# Altium schematic sheet 51-039原理图（源文件格式）.SCHDOC
size A4
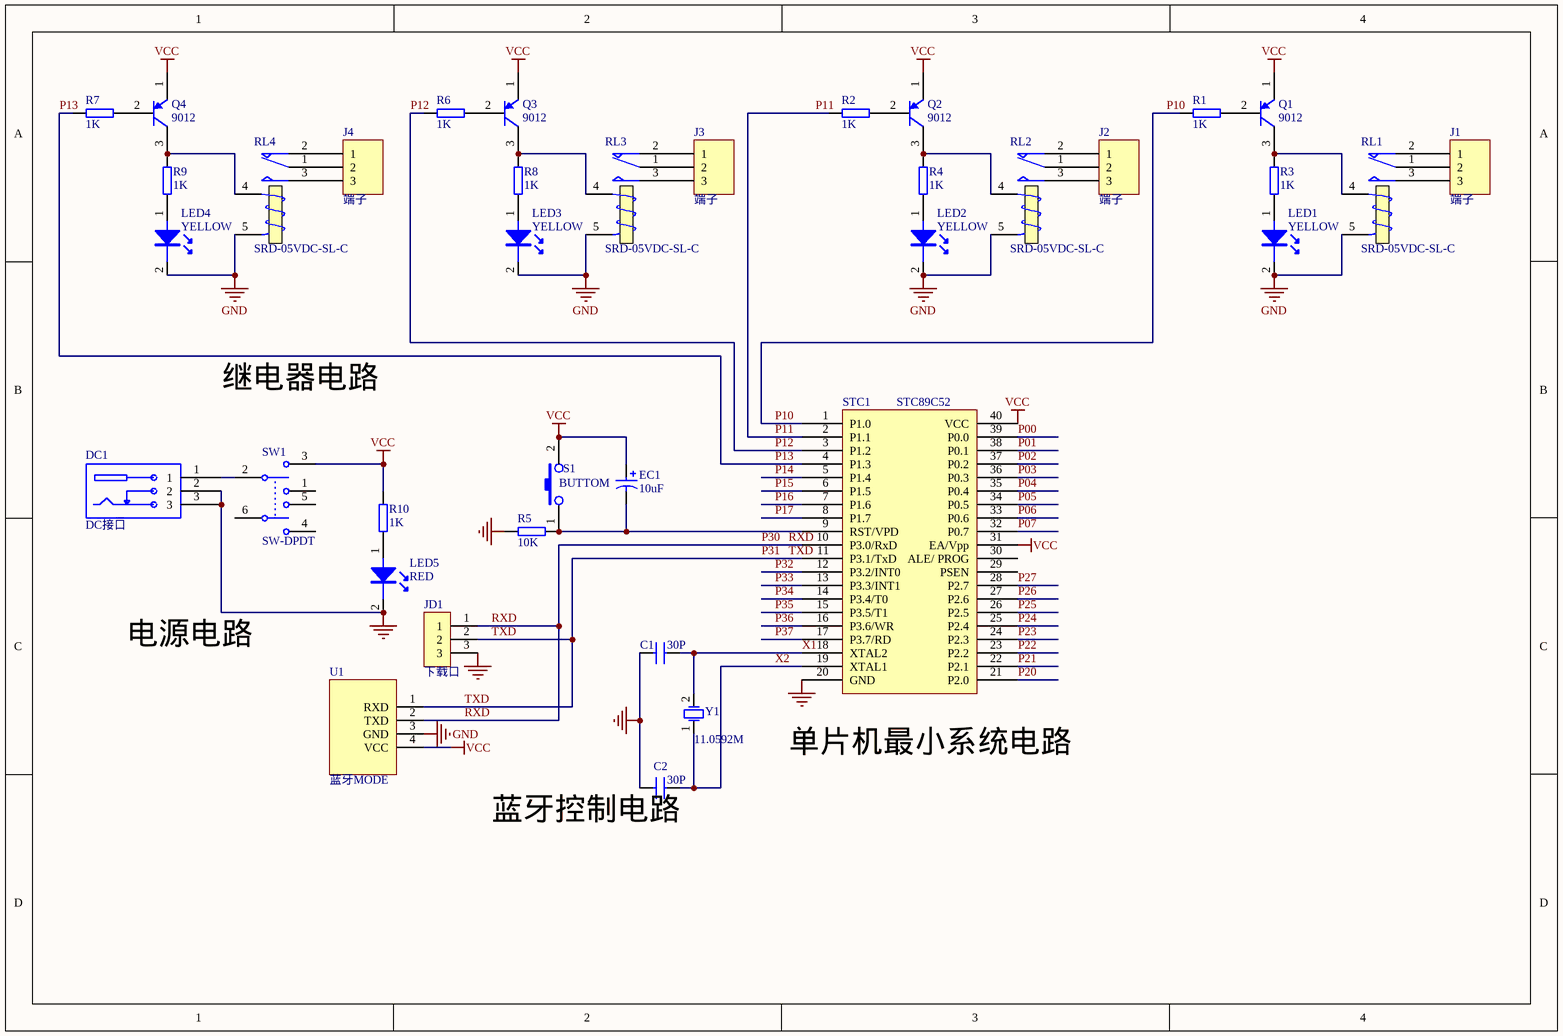
[diagram p0: 51-039原理图（源文件格式）.SCHDOC]

## Parts
C1  30P  [RAD-0.1]
C2  30P  [RAD-0.1]
DC1  DC接口  [DC-JACK-002]
EC1  10uF  [RB.1/.2]
J1  端子  [5.08三芯接线端子]
J2  端子  [5.08三芯接线端子]
J3  端子  [5.08三芯接线端子]
J4  端子  [5.08三芯接线端子]
JD1  下载口  [下载串口]
LED1  YELLOW  [LED_D3MM12]
LED2  YELLOW  [LED_D3MM12]
LED3  YELLOW  [LED_D3MM12]
LED4  YELLOW  [LED_D3MM12]
LED5  RED  [LED_D3MM12]
Q1  9012  [TO-92]
Q2  9012  [TO-92]
Q3  9012  [TO-92]
Q4  9012  [TO-92]
R1  1K  [AXIAL0.3]
R2  1K  [AXIAL0.3]
R3  1K  [AXIAL0.3]
R4  1K  [AXIAL0.3]
R5  10K  [AXIAL0.3]
R6  1K  [AXIAL0.3]
R7  1K  [AXIAL0.3]
R8  1K  [AXIAL0.3]
R9  1K  [AXIAL0.3]
R10  1K  [AXIAL0.3]
RL1  SRD-05VDC-SL-C  [RELAY_5V51BOARD]
RL2  SRD-05VDC-SL-C  [RELAY_5V51BOARD]
RL3  SRD-05VDC-SL-C  [RELAY_5V51BOARD]
RL4  SRD-05VDC-SL-C  [RELAY_5V51BOARD]
S1  BUTTOM  [BUTTOM_6x6DIP]
STC1  STC89C52  [STC89]
SW1  SW-DPDT  [SW]
U1  蓝牙MODE  [蓝牙MODE竖放]
Y1  11.0592M  [X_HC-49]

## Nets
GND: C1.1 C2.1 DC1.2 DC1.3 JD1.3 LED1.2 LED2.2 LED3.2 LED4.2 LED5.2 R5.1 RL1.5(T2) RL2.5(T2) RL3.5(T2) RL4.5(T2) STC1.20(GND) U1.3(GND)
VCC: EC1.1 Q1.1(e) Q2.1(e) Q3.1(e) Q4.1(e) R10.2 S1.2 STC1.31(EA/Vpp) STC1.40(VCC) SW1.3 U1.4(VCC)
P00: STC1.39(P0.0)
P01: STC1.38(P0.1)
P02: STC1.37(P0.2)
P03: STC1.36(P0.3)
P04: STC1.35(P0.4)
P05: STC1.34(P0.5)
P06: STC1.33(P0.6)
P07: STC1.32(P0.7)
P10: R1.2 STC1.1(P1.0)
P11: R2.2 STC1.2(P1.1)
P12: R6.2 STC1.3(P1.2)
P13: R7.2 STC1.4(P1.3)
P14: STC1.5(P1.4)
P15: STC1.6(P1.5)
P16: STC1.7(P1.6)
P17: STC1.8(P1.7)
P20: STC1.21(P2.0)
P21: STC1.22(P2.1)
P22: STC1.23(P2.2)
P23: STC1.24(P2.3)
P24: STC1.25(P2.4)
P25: STC1.26(P2.5)
P26: STC1.27(P2.6)
P27: STC1.28(P2.7)
P30: JD1.1 STC1.10(P3.0/RxD) U1.2(TXD)  [also labelled RXD]
P31: JD1.2 STC1.11(P3.1/TxD) U1.1(RXD)  [also labelled TXD]
P32: STC1.12(P3.2/INT0)
P33: STC1.13(P3.3/INT1)
P34: STC1.14(P3.4/T0)
P35: STC1.15(P3.5/T1)
P36: STC1.16(P3.6/WR)
P37: STC1.17(P3.7/RD)
X1: C1.2 STC1.18(XTAL2) Y1.2(OSC2)
X2: C2.2 STC1.19(XTAL1) Y1.1(OSC1)
NetDC1_1: DC1.1 SW1.2
NetEC1_2: EC1.2 R5.2 S1.1 STC1.9(RST/VPD)
NetJ1_1: J1.1 RL1.2(NC)
NetJ1_2: J1.2 RL1.1(COM)
NetJ1_3: J1.3 RL1.3(NO)
NetJ2_1: J2.1 RL2.2(NC)
NetJ2_2: J2.2 RL2.1(COM)
NetJ2_3: J2.3 RL2.3(NO)
NetJ3_1: J3.1 RL3.2(NC)
NetJ3_2: J3.2 RL3.1(COM)
NetJ3_3: J3.3 RL3.3(NO)
NetJ4_1: J4.1 RL4.2(NC)
NetJ4_2: J4.2 RL4.1(COM)
NetJ4_3: J4.3 RL4.3(NO)
NetLED1_1: LED1.1 R3.2
NetLED2_1: LED2.1 R4.2
NetLED3_1: LED3.1 R8.2
NetLED4_1: LED4.1 R9.2
NetLED5_1: LED5.1 R10.1
NetQ1_2: Q1.2(b) R1.1
NetQ1_3: Q1.3(c) R3.1 RL1.4(T1)
NetQ2_2: Q2.2(b) R2.1
NetQ2_3: Q2.3(c) R4.1 RL2.4(T1)
NetQ3_2: Q3.2(b) R6.1
NetQ3_3: Q3.3(c) R8.1 RL3.4(T1)
NetQ4_2: Q4.2(b) R7.1
NetQ4_3: Q4.3(c) R9.1 RL4.4(T1)

Not connected (* = marked no-connect by the designer): STC1 29(PSEN) 30(ALE/_PROG); SW1 1 4 5 6

## Notes on the sheet
- 继电器电路
- 电源电路
- (near STC1) 单片机最小系统电路
- (near U1) 蓝牙控制电路

## Library data of the parts
C1 C2 = CAP: 无极性电容
DC1 = DC接口: DC接口（分大小）
EC1 = CAP_EC: 极性电容
J1-J4 = CON3: 接线端子3芯; LatestRevisionDate: 17-Jul-2002; LatestRevisionNote: Re-released for DXP Platform.; Publisher: Altium Limited
JD1 = 下载口: 下载口2.54排针
LED1-LED5 = LED: LED灯
Q1-Q4 = 9012: 直插三极管
R1-R10 = RES: 电阻
RL1-RL4 = RELAY: 继电器; Published: 8-Jun-2000; LatestRevisionDate: 17-Jul-2002; LatestRevisionNote: Re-released for DXP Platform.; PackageReference: MODULE5B; Publisher: Altium Limited
S1 = BUTTOM: 按键
STC1 = STC51: 51单片机
SW1 = SW-DPDT: 电源开关; Published: 24-Mar-1999; LatestRevisionDate: 17-Jul-2002; LatestRevisionNote: Re-released for DXP Platform.; PackageReference: DPDT-6; Publisher: Altium Limited
U1 = 蓝牙MODE: 蓝牙模块
Y1 = XTAL DIP: 晶振